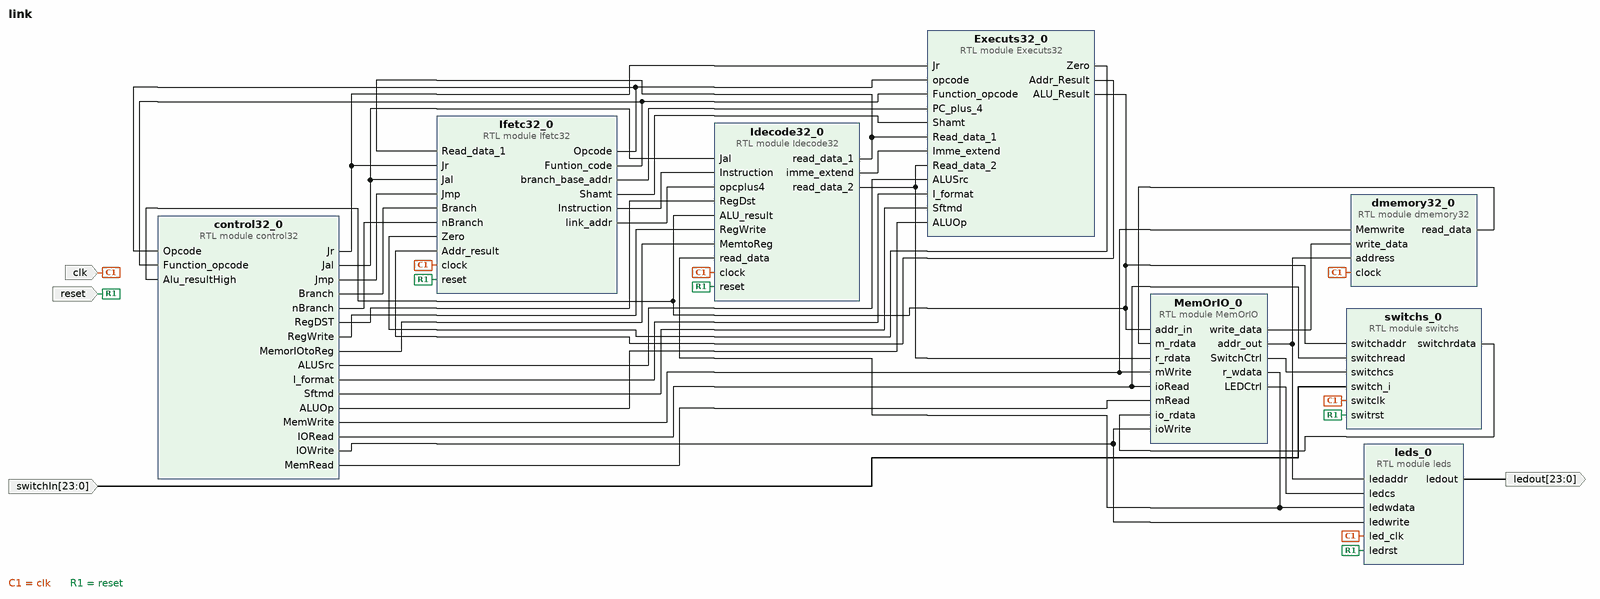
[diagram p0: block diagram of the top level]
# Vivado block design link, xc7a100tfgg484-1, Vivado 2017.4
create_bd_design link

create_bd_port -dir O -from 23 -to 0 ledout
create_bd_port -dir I -from 23 -to 0 switchIn
create_bd_port -dir I -type clk clk
set_property -dict {CONFIG.FREQ_HZ 23000000} [get_bd_ports clk]
create_bd_port -dir I reset

create_bd_cell -type module -reference Executs32 Executs32_0
create_bd_cell -type module -reference control32 control32_0
create_bd_cell -type module -reference Ifetc32 Ifetc32_0
create_bd_cell -type module -reference Idecode32 Idecode32_0
create_bd_cell -type module -reference MemOrIO MemOrIO_0
create_bd_cell -type module -reference leds leds_0
create_bd_cell -type module -reference switchs switchs_0
create_bd_cell -type module -reference dmemory32 dmemory32_0

# ---- connections ----

connect_bd_net [get_bd_pins Ifetc32_0/Instruction] [get_bd_pins Idecode32_0/Instruction]
connect_bd_net [get_bd_pins Ifetc32_0/link_addr] [get_bd_pins Idecode32_0/opcplus4]
connect_bd_net [get_bd_pins Ifetc32_0/branch_base_addr] [get_bd_pins Executs32_0/PC_plus_4]
connect_bd_net [get_bd_pins Ifetc32_0/Opcode] [get_bd_pins Executs32_0/opcode] [get_bd_pins control32_0/Opcode]
connect_bd_net [get_bd_pins Ifetc32_0/Funtion_code] [get_bd_pins Executs32_0/Function_opcode] [get_bd_pins control32_0/Function_opcode]
connect_bd_net [get_bd_pins Ifetc32_0/Shamt] [get_bd_pins Executs32_0/Shamt]
connect_bd_net [get_bd_pins Idecode32_0/read_data_1] [get_bd_pins Executs32_0/Read_data_1] [get_bd_pins Ifetc32_0/Read_data_1]
connect_bd_net [get_bd_pins Idecode32_0/imme_extend] [get_bd_pins Executs32_0/Imme_extend]
connect_bd_net [get_bd_pins control32_0/Jr] [get_bd_pins Executs32_0/Jr] [get_bd_pins Ifetc32_0/Jr]
connect_bd_net [get_bd_pins control32_0/Jmp] [get_bd_pins Ifetc32_0/Jmp]
connect_bd_net [get_bd_pins control32_0/Jal] [get_bd_pins Ifetc32_0/Jal] [get_bd_pins Idecode32_0/Jal]
connect_bd_net [get_bd_pins control32_0/Branch] [get_bd_pins Ifetc32_0/Branch]
connect_bd_net [get_bd_pins control32_0/nBranch] [get_bd_pins Ifetc32_0/nBranch]
connect_bd_net [get_bd_pins control32_0/RegDST] [get_bd_pins Idecode32_0/RegDst]
connect_bd_net [get_bd_pins control32_0/RegWrite] [get_bd_pins Idecode32_0/RegWrite]
connect_bd_net [get_bd_pins control32_0/ALUSrc] [get_bd_pins Executs32_0/ALUSrc]
connect_bd_net [get_bd_pins control32_0/I_format] [get_bd_pins Executs32_0/I_format]
connect_bd_net [get_bd_pins control32_0/Sftmd] [get_bd_pins Executs32_0/Sftmd]
connect_bd_net [get_bd_pins control32_0/ALUOp] [get_bd_pins Executs32_0/ALUOp]
connect_bd_net [get_bd_pins control32_0/MemWrite] [get_bd_pins MemOrIO_0/mWrite] [get_bd_pins dmemory32_0/Memwrite]
connect_bd_net [get_bd_pins Executs32_0/Zero] [get_bd_pins Ifetc32_0/Zero]
connect_bd_net [get_bd_pins Executs32_0/Addr_Result] [get_bd_pins Ifetc32_0/Addr_result]
connect_bd_net [get_bd_pins control32_0/IORead] [get_bd_pins MemOrIO_0/ioRead] [get_bd_pins switchs_0/switchread]
connect_bd_net [get_bd_pins control32_0/IOWrite] [get_bd_pins MemOrIO_0/ioWrite] [get_bd_pins leds_0/ledwrite]
connect_bd_net [get_bd_pins control32_0/MemRead] [get_bd_pins MemOrIO_0/mRead]
connect_bd_net [get_bd_pins control32_0/MemorIOtoReg] [get_bd_pins Idecode32_0/MemtoReg]
connect_bd_net [get_bd_pins Executs32_0/ALU_Result] \
  [get_bd_pins control32_0/Alu_resultHigh] [get_bd_pins Idecode32_0/ALU_result] [get_bd_pins MemOrIO_0/addr_in] \
  [get_bd_pins switchs_0/switchaddr]
connect_bd_net [get_bd_pins MemOrIO_0/addr_out] [get_bd_pins leds_0/ledaddr] [get_bd_pins dmemory32_0/address]
connect_bd_net [get_bd_pins Idecode32_0/read_data_2] [get_bd_pins Executs32_0/Read_data_2] [get_bd_pins MemOrIO_0/r_rdata]
connect_bd_net [get_bd_pins MemOrIO_0/write_data] [get_bd_pins dmemory32_0/write_data]
connect_bd_net [get_bd_pins MemOrIO_0/r_wdata] [get_bd_pins Idecode32_0/read_data] [get_bd_pins leds_0/ledwdata]
connect_bd_net [get_bd_pins dmemory32_0/read_data] [get_bd_pins MemOrIO_0/m_rdata]
connect_bd_net [get_bd_pins MemOrIO_0/LEDCtrl] [get_bd_pins leds_0/ledcs]
connect_bd_net [get_bd_pins leds_0/ledout] [get_bd_ports ledout]
connect_bd_net [get_bd_ports switchIn] [get_bd_pins switchs_0/switch_i]
connect_bd_net [get_bd_pins MemOrIO_0/SwitchCtrl] [get_bd_pins switchs_0/switchcs]
connect_bd_net [get_bd_pins switchs_0/switchrdata] [get_bd_pins MemOrIO_0/io_rdata]
connect_bd_net [get_bd_ports clk] \
  [get_bd_pins Ifetc32_0/clock] [get_bd_pins Idecode32_0/clock] [get_bd_pins leds_0/led_clk] [get_bd_pins switchs_0/switclk] \
  [get_bd_pins dmemory32_0/clock]
connect_bd_net [get_bd_ports reset] \
  [get_bd_pins Ifetc32_0/reset] [get_bd_pins Idecode32_0/reset] [get_bd_pins leds_0/ledrst] [get_bd_pins switchs_0/switrst]

validate_bd_design
save_bd_design
